# Altium project PickPlaceFeeder.PrjPcb
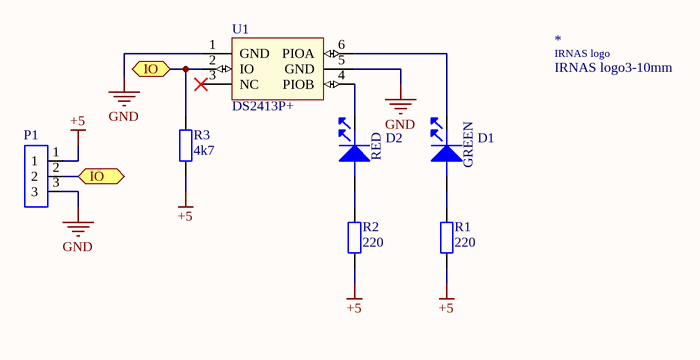
[diagram p0: PickPlaceFeederSCH.SchDoc]
ProjectTitle: PickPlace Feeder; Version: V0.1
1 sheet, 8 parts. Net scope: flat (ports and power ports of the same name join across sheets).
Board file: PickPlaceFeederPCB.PcbDoc

## Sheet PickPlaceFeederSCH.SchDoc
size A3; DocumentNumber: 1; SheetNumber: 1; SheetTotal: 1

### Parts
*  IRNAS logo3-10mm  [LOGO_3-10mm]
D1  LED GREEN  [LED0603]  (value not drawn)
D2  LED RED  [LED0603]  (value not drawn)
P1  (no value)  [Pogo_pin_3pos_90deg]
R1  Resistance: 220  [Res [0603/1608]]  (hidden comment: CRCW06030000Z0EAHP)
R2  Resistance: 220  [Res [0603/1608]]  (hidden comment: CRCW06030000Z0EAHP)
R3  Resistance: 4k7  [Res [0603/1608]]  (hidden comment: CRCW06034K70JNEA)
U1  DS2413P+  [TSOC-6]

### Ports
IO (bidir)

### Nets
+5: P1.1 R1.1 R2.1 R3.1
GND: P1.3 U1.1(GND) U1.5(GND)
NetD1_1: D1.1(cathode) U1.6(PIOA)
NetD1_2: D1.2(ANODE) R1.2
NetD2_1: D2.1(cathode) U1.4(PIOB)
NetD2_2: D2.2(ANODE) R2.2
NetP1_2: P1.2 R3.2 U1.2(IO) ; port IO

Not connected (* = marked no-connect by the designer): U1 3(NC)*

### Notes on the sheet
- Description 1
- Contents:
- Description 2
- PAGE1 - ?
- PAGE2 - ?
- PAGE3 - ?
- PAGE4 - ?
- PAGE5 - ?
- PAGE6 - ?
- Version Revision:
- v0.1 - dd.mm.yyyy
- v1.0 - dd.mm.yyyy
- v1.1 - dd.mm.yyyy
- v1.2 - dd.mm.yyyy
- v2.0 - dd.mm.yyyy
- v2.1 - dd.mm.yyyy
- v2.2 - dd.mm.yyyy
- v2.3 - dd.mm.yyyy
- D  E  S  I  G  N     C  O  N  S  I  D  E  R  A  T  I  O  N  S
- DESIGN NOTE:
  Example text for informational
  design notes.
- LAYOUT NOTE:
  Example text for critical
  layout guidelines.
- DESIGN NOTE:
  Example text for critical
  design notes.
- CreateDate:
- RevisionDate:
- Developed by
- IRNAS
- Version:
- Sheet
- of
- (in symbol IRNAS logo3-10mm) IRNAS logo
- (in symbol LED - LED GREEN) GREEN
- (in symbol LED - LED RED) RED

### Library data of the parts
D1 = LED - LED GREEN: HSME-C191 -  LED, Green, SMD, 0603, 20 mA, 2.1 V, 572 nm; Manufacturer: BROADCOM LIMITED; Manufacturer Part Number: HSMS-C190; LED Colour: Red; Forward Current If: 20; Forward Voltage: 2.1; Wavelength Typ: 626; Luminous Intensity: 10; Viewing Angle: 170°; Lens Shape: Rectangular; SVHC: No SVHC (17-Dec-2015)<!--FANDB--><div class="features-and-benefits-container"><div class="features-and-benefits-description"><span class="features-benefits-value">The HSMS-C190 is a HER SMD Chip LED with untinted/diffused lens, made of GaP. It is designed in an industry standard package 1.6 x 0.8mm footprint with 0.8mm profile. It is compatible with IR reflow solder processes. The small size and wide viewing angle make this LED prime choices for backlighting applications and front panel illumination especially where space is a premium.</span></div><div class="features-and-benefits-list"><ul class="features-and-benefits-list-list"><li class="features-and-benefits-list-item">Small size</li><li class="features-and-benefits-list-item">Industry standard footprint</li><li class="features-and-benefits-list-item">Compatible with IR solder</li><li class="features-and-benefits-list-item">Diffused optics</li><li class="features-and-benefits-list-item">-40 to 85; RoHS: YES; Stock 1: 7534; Pricing 1: 1=0.361, 10=0.256, 50=0.235, 100=0.106, 200=0.101 (GBP); LED Mounting: SMD; Bulb Size: -; Packaging: Cut Tape; Product Range: -; Automotive Qualification Standard: -; MSL: -; ComponentLink3URL: http://www.farnell.com/datasheets/2095939.pdf?_ga=2.85835929.1644194861.1561957338-1373726713.1554121096; ComponentLink3Description: Datasheet; Supplier 1: Farnell; Supplier Part Number 1: 1219743
D2 = LED - LED RED: BROADCOM LIMITED - HSMS-C190 - LED, RED, 10MCD, 626NM; LED Mounting: SMD; Forward Current If: 20; Forward Voltage: 2.1; Wavelength Typ: 626; Luminous Intensity: 10; Viewing Angle: 170°; Lens Shape: Rectangular; SVHC: No SVHC (17-Dec-2015)<!--FANDB--><div class="features-and-benefits-container"><div class="features-and-benefits-description"><span class="features-benefits-value">The HSMS-C190 is a HER SMD Chip LED with untinted/diffused lens, made of GaP. It is designed in an industry standard package 1.6 x 0.8mm footprint with 0.8mm profile. It is compatible with IR reflow solder processes. The small size and wide viewing angle make this LED prime choices for backlighting applications and front panel illumination especially where space is a premium.</span></div><div class="features-and-benefits-list"><ul class="features-and-benefits-list-list"><li class="features-and-benefits-list-item">Small size</li><li class="features-and-benefits-list-item">Industry standard footprint</li><li class="features-and-benefits-list-item">Compatible with IR solder</li><li class="features-and-benefits-list-item">Diffused optics</li><li class="features-and-benefits-list-item">-40 to 85; Supplier 1: Farnell; Manufacturer: BROADCOM LIMITED; Manufacturer Part Number: HSMS-C190; RoHS: YES; Stock 1: 7534; Pricing 1: 1=0.361, 10=0.256, 50=0.235, 100=0.106, 200=0.101 (GBP); LED Colour: Red; Bulb Size: -; Packaging: Cut Tape; Product Range: -; Automotive Qualification Standard: -; MSL: -; ComponentLink1URL: http://www.farnell.com/datasheets/313031.pdf; ComponentLink1Description: http://www.farnell.com/datasheets/313031.pdf; ComponentLink2URL: http://www.farnell.com/datasheets/1681524.pdf; ComponentLink2Description: http://www.farnell.com/datasheets/1681524.pdf; ComponentLink3URL: http://www.farnell.com/datasheets/2165483.pdf; ComponentLink3Description: http://www.farnell.com/datasheets/2165483.pdf; Supplier Part Number 1: 2497356
P1 = Pogo_pin_SMD [3 positions, 90deg, SMD]
R1 R2 = Res_220_Ohm_[0603/1608]: Res Thick Film 0603 220 Ohm 5% 1/10W ±200ppm/°C Molded SMD Paper T/R; Manufacturer: Vishay Dale; Power Rating: 250mW; Voltage Rating: 75V; Supplier 1: Mouser; Manufacturer Part Number: CRCW06030000Z0EAHP; RoHS: Yes; Category: Chip SMD Resistors; Stock 1: 129043; Pricing 1: 1=0.14000, 10=0.06200, 50=0.06200, 100=0.03300, 1000=0.02300, 10000=0.01600 (USD); Mount: Surface Mount; Case/Package: 0603; Number of Pins: 2; Contact Plating: Tin; Weight: 7.1E-05oz; Case Code (Metric): 1608; Case Code (Imperial): 0603; Size Code: 0603; Min Operating Temperature: -55°C; Max Operating Temperature: 155°C; Resistor Type: Thick Film; Termination: SMD/SMT; Package Quantity: 5000; Packaging: Tape and Reel; Number of Terminations: 2; Max Power Dissipation: 250mW; Temperature Coefficient: 0ppm/°C; Voltage Rating (DC): 75V; Features: Automotive AEC-Q200; Series: CRCW-HP; Technology: THICK FILM; Construction: Rectangular; Length: 1.6mm; Width: 0.033inch; Height: 0.45mm; Depth: 0.85mm; Radiation Hardening: No; Lead Free: Lead Free; RoHS Compliant: Yes; REACH SVHC: Unknown; Military Standard: Not; ComponentLink1URL: https://datasheet.ciiva.com/2472/crcwhpe3-2472033.pdf?src-supplier=Digi-Key; ComponentLink1Description: https://datasheet.ciiva.com/2472/crcwhpe3-2472033.pdf?src-supplier=Digi-Key; ComponentLink2URL: https://datasheet.ciiva.com/2472/crcwhpe3-2472034.pdf?src-supplier=Digi-Key; ComponentLink2Description: https://datasheet.ciiva.com/2472/crcwhpe3-2472034.pdf?src-supplier=Digi-Key; ComponentLink3URL: https://datasheet.ciiva.com/2472/crcwhpe3-2472035.pdf?src-supplier=Digi-Key; ComponentLink3Description: https://datasheet.ciiva.com/2472/crcwhpe3-2472035.pdf?src-supplier=Digi-Key; ComponentLink4URL: https://datasheet.ciiva.com/8340/crcwhpe3-8340198.pdf?src-supplier=Avnet; ComponentLink4Description: https://datasheet.ciiva.com/8340/crcwhpe3-8340198.pdf?src-supplier=Avnet; ComponentLink5URL: https://datasheet.ciiva.com/16430/crcwhpe3-16430059.pdf?src-supplier=Future+Electronics; ComponentLink5Description: https://datasheet.ciiva.com/16430/crcwhpe3-16430059.pdf?src-supplier=Future+Electronics; ComponentLink6URL: https://datasheet.ciiva.com/28621/1912814-28621358.pdf?src-supplier=Element14; ComponentLink6Description: https://datasheet.ciiva.com/28621/1912814-28621358.pdf?src-supplier=Element14; Supplier Part Number 1: 71-CRCW06030000Z0EAH; Supplier 2: Mouser; Stock 2: 26122; Pricing 2: 1=0.10000, 10=0.03400, 50=0.03400, 100=0.01400, 1000=0.00700, 10000=0.00500 (USD); Tolerance: 5%; Working Voltage: 75V; Resistance Tolerance: 5%; ComponentLink7URL: https://datasheet.ciiva.com/2524/dcrcwe3-2524384.pdf?src-supplier=Digi-Key; ComponentLink7Description: https://datasheet.ciiva.com/2524/dcrcwe3-2524384.pdf?src-supplier=Digi-Key; ComponentLink8URL: https://datasheet.ciiva.com/2524/dcrcwe3-2524385.pdf?src-supplier=Digi-Key; ComponentLink8Description: https://datasheet.ciiva.com/2524/dcrcwe3-2524385.pdf?src-supplier=Digi-Key; ComponentLink9URL: https://datasheet.ciiva.com/2524/dcrcwe3-2524386.pdf?src-supplier=Digi-Key; ComponentLink9Description: https://datasheet.ciiva.com/2524/dcrcwe3-2524386.pdf?src-supplier=Digi-Key; ComponentLink10URL: https://datasheet.ciiva.com/8339/dcrcwe3-8339958.pdf?src-supplier=Avnet; ComponentLink10Description: https://datasheet.ciiva.com/8339/dcrcwe3-8339958.pdf?src-supplier=Avnet; ComponentLink11URL: https://datasheet.ciiva.com/22869/70201119-22869142.pdf?src-supplier=Allied+Electronics; ComponentLink11Description: https://datasheet.ciiva.com/22869/70201119-22869142.pdf?src-supplier=Allied+Electronics; ComponentLink12URL: https://datasheet.ciiva.com/46448/1807946-46448601.pdf?src-supplier=Element14; ComponentLink12Description: https://datasheet.ciiva.com/46448/1807946-46448601.pdf?src-supplier=Element14; ComponentLink13URL: https://datasheet.ciiva.com/5550/dcrcwe3-109170-5550730.pdf?src-supplier=Mouser; ComponentLink13Description: https://datasheet.ciiva.com/5550/dcrcwe3-109170-5550730.pdf?src-supplier=Mouser; Supplier Part Number 2: 71-CRCW0603J-220-E3
R3 = Res_4k7_Ohm_[0603/1608]: Res Thick Film 0603 4.7 kOhm 5% 0.1W(1/10W) ±200ppm/°C Pad SMD T/R; Manufacturer: Vishay; Power Rating: 100mW; Voltage Rating: 75V; Supplier 1: Mouser; Manufacturer Part Number: CRCW06034K70JNEA; RoHS: Yes; Category: Chip SMD Resistors; Pricing 1: 1=0.10000, 10=0.03400, 50=0.03400, 100=0.01400, 1000=0.00700, 10000=0.00500 (USD); Mount: Surface Mount; Case/Package: 0603; Weight: 7.1E-05oz; Case Code (Imperial): 0603; Case Code (Metric): 1608; Contact Plating: Tin; Size Code: 0603; Min Operating Temperature: -55°C; Max Operating Temperature: 155°C; Package Quantity: 1; Tolerance: 5%; Packaging: Tape and Reel; Termination: SMD/SMT; Resistor Type: Thick Film; Number of Terminations: 2; Temperature Coefficient: 200ppm/°C; Max Power Dissipation: 100mW; Voltage Rating (DC): 75V; Features: Automotive AEC-Q200; Series: CRCW; Resistance Tolerance: 5%; Technology: THICK FILM; Construction: Rectangular; Length: 1.55mm; Width: 0.85mm; Height: 0.45mm; Depth: 0.85mm; Radiation Hardening: No; REACH SVHC: Unknown; Military Standard: Not; Lead Free: Lead Free; RoHS Compliant: Yes; ComponentLink1URL: https://datasheet.ciiva.com/16215/dcrcwe3-16215767.pdf?src-supplier=Future+Electronics; ComponentLink1Description: https://datasheet.ciiva.com/16215/dcrcwe3-16215767.pdf?src-supplier=Future+Electronics; ComponentLink2URL: https://datasheet.ciiva.com/5546/dcrcwe3-109170-5546457.pdf?src-supplier=Mouser; ComponentLink2Description: https://datasheet.ciiva.com/5546/dcrcwe3-109170-5546457.pdf?src-supplier=Mouser; ComponentLink3URL: https://datasheet.ciiva.com/2461/dcrcwe3-2461995.pdf?src-supplier=Digi-Key; ComponentLink3Description: https://datasheet.ciiva.com/2461/dcrcwe3-2461995.pdf?src-supplier=Digi-Key; ComponentLink4URL: https://datasheet.ciiva.com/16755/70201119-16755067.pdf?src-supplier=Allied+Electronics; ComponentLink4Description: https://datasheet.ciiva.com/16755/70201119-16755067.pdf?src-supplier=Allied+Electronics; ComponentLink5URL: https://datasheet.ciiva.com/26821/getdatasheetpartid-88043-26821115.pdf?src-supplier=Verical; ComponentLink5Description: https://datasheet.ciiva.com/26821/getdatasheetpartid-88043-26821115.pdf?src-supplier=Verical; ComponentLink6URL: https://datasheet.ciiva.com/2461/dcrcwe3-2461996.pdf?src-supplier=Digi-Key; ComponentLink6Description: https://datasheet.ciiva.com/2461/dcrcwe3-2461996.pdf?src-supplier=Digi-Key; ComponentLink7URL: https://datasheet.ciiva.com/2461/dcrcwe3-2461997.pdf?src-supplier=Digi-Key; ComponentLink7Description: https://datasheet.ciiva.com/2461/dcrcwe3-2461997.pdf?src-supplier=Digi-Key; ComponentLink8URL: https://datasheet.ciiva.com/16772/70201119-16772847.pdf?src-supplier=Allied+Electronics; ComponentLink8Description: https://datasheet.ciiva.com/16772/70201119-16772847.pdf?src-supplier=Allied+Electronics; Supplier Part Number 1: 71-CRCW0603J-4.7K-E3
U1 = DS2413P+: 1-Wire, Dual-Channel, Addressable Switch Features Open-Drain, Programmable I/O Pins; Manufacturer: Maxim; Min Supply Voltage: 2.8V; Max Supply Voltage: 5.25V; Operating Supply Current: 70uA; On-State Resistance: 20R; Quiescent Current: 24uA; Low Level Output Current: 20mA; Throw Configuration: SPST; Supplier 1: Mouser; Supplier 2: Farnell; Manufacturer Part Number: DS2413P+; RoHS: Yes; Category: Memory; Mount: Surface Mount; Number of Pins: 6; Contact Plating: Tin,Matte; Min Operating Temperature: 0°C; Max Operating Temperature: 70°C; Packaging: Rail/Tube; Package Quantity: 120; Series: -; Length: 4mm; Width: 3.89mm; Height: 1.35mm; Radiation Hardening: No; RoHS Compliant: Yes; Lead Free: Lead Free; REACH SVHC: Unknown; ComponentLink1URL: https://datasheet.ciiva.com/2080/ds2413-2080624.pdf?src-supplier=Digi-Key; ComponentLink1Description: https://datasheet.ciiva.com/2080/ds2413-2080624.pdf?src-supplier=Digi-Key; ComponentLink2URL: https://datasheet.ciiva.com/1176/ds2413-1176081.pdf?src-supplier=Newark; ComponentLink2Description: https://datasheet.ciiva.com/1176/ds2413-1176081.pdf?src-supplier=Newark; ComponentLink3URL: https://datasheet.ciiva.com/14100/07386164-14100015.pdf?src-supplier=Distrelec; ComponentLink3Description: https://datasheet.ciiva.com/14100/07386164-14100015.pdf?src-supplier=Distrelec; ComponentLink4URL: https://datasheet.ciiva.com/16617/ds2413-16617017.pdf?src-supplier=Avnet+Europe; ComponentLink4Description: https://datasheet.ciiva.com/16617/ds2413-16617017.pdf?src-supplier=Avnet+Europe; ComponentLink5URL: https://datasheet.ciiva.com/1171/ds2413-1171804.pdf?src-supplier=Farnell; ComponentLink5Description: https://datasheet.ciiva.com/1171/ds2413-1171804.pdf?src-supplier=Farnell; ComponentLink6URL: https://datasheet.ciiva.com/1168/1911564-1168205.pdf?src-supplier=Element14; ComponentLink6Description: https://datasheet.ciiva.com/1168/1911564-1168205.pdf?src-supplier=Element14; Supplier Part Number 1: 700-DS2413P; Supplier Part Number 2: 2072030